# Altium schematic sheet JLINK_OB_TYPEC.SchDoc
size 292 x 193 mm
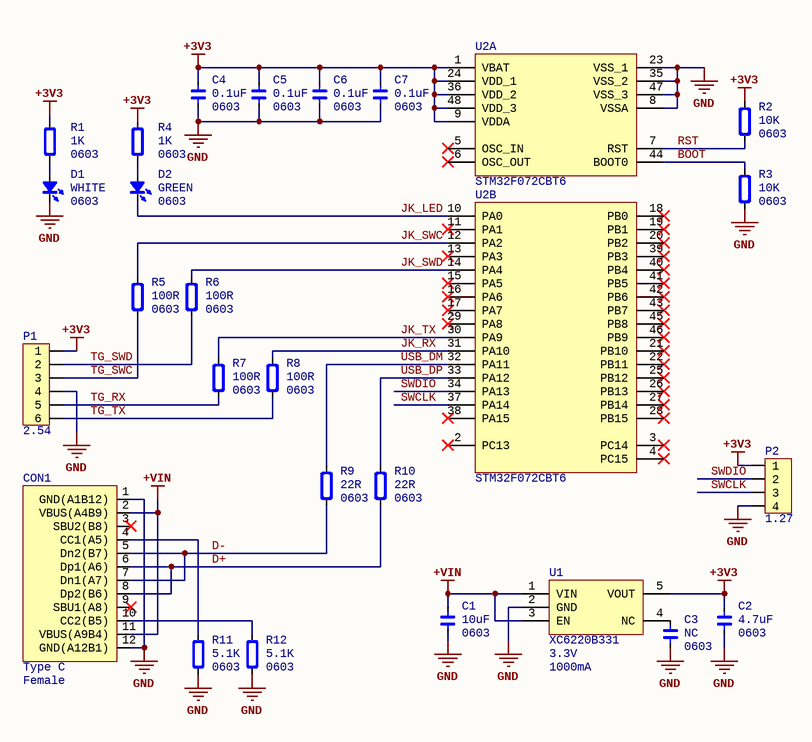
[diagram p0: JLINK_OB_TYPEC.SchDoc]

## Parts
C1  value 10uF  Type: 0603  [CAP_0603]  (hidden comment: C0603)
C2  value 4.7uF  Type: 0603  [CAP_0603]  (hidden comment: C0603)
C3  value NC  Type: 0603  [CAP_0603]  (hidden comment: C0603)
C4  value 0.1uF  Type: 0603  [CAP_0603]  (hidden comment: C0603)
C5  value 0.1uF  Type: 0603  [CAP_0603]  (hidden comment: C0603)
C6  value 0.1uF  Type: 0603  [CAP_0603]  (hidden comment: C0603)
C7  value 0.1uF  Type: 0603  [CAP_0603]  (hidden comment: C0603)
CON1  value Type C  Type: Female  [USB_TypeC_16P]  (hidden comment: USB Type C)
D1  value WHITE  Type: 0603  [LED_0603_YELLOW]  (hidden comment: D0603)
D2  value GREEN  Type: 0603  [LED_0603_GREEN]  (hidden comment: D0603)
P1  value 2.54  [HDR1X6_2.54_180]  (hidden comment: HDR1x6)
P2  value 1.27  [HDR1X4_1.27_180]  (hidden comment: HDR1x4)
R1  value 1K  Type: 0603  [RES_0603]  (hidden comment: R0603)
R2  value 10K  Type: 0603  [RES_0603]  (hidden comment: R0603)
R3  value 10K  Type: 0603  [RES_0603]  (hidden comment: R0603)
R4  value 1K  Type: 0603  [RES_0603]  (hidden comment: R0603)
R5  value 100R  Type: 0603  [RES_0603]  (hidden comment: R0603)
R6  value 100R  Type: 0603  [RES_0603]  (hidden comment: R0603)
R7  value 100R  Type: 0603  [RES_0603]  (hidden comment: R0603)
R8  value 100R  Type: 0603  [RES_0603]  (hidden comment: R0603)
R9  value 22R  Type: 0603  [RES_0603]  (hidden comment: R0603)
R10  value 22R  Type: 0603  [RES_0603]  (hidden comment: R0603)
R11  value 5.1K  Type: 0603  [RES_0603]  (hidden comment: R0603)
R12  value 5.1K  Type: 0603  [RES_0603]  (hidden comment: R0603)
U1  XC6220B331  value 3.3V  Specification: 1000mA  [SOT23-5]
U2  STM32F072CBT6  [LQFP48_P0.5_7.0x7.0]  (parts A,B of 2)

## Nets
+3V3: C2.2 C4.2 C5.2 C6.2 C7.2 P1.1 P2.1 R1.2 R2.2 R4.2 U1.5(VOUT) U2.1(VBAT) U2.9(VDDA) U2.24(VDD_1) U2.36(VDD_2) U2.48(VDD_3)
+VIN: C1.2 CON1.2(VBUS(A4B9)) CON1.11(VBUS(A9B4)) U1.1(VIN) U1.3(EN)
GND: C1.1 C2.1 C3.1 C4.1 C5.1 C6.1 C7.1 CON1.1(GND(A1B12)) CON1.12(GND(A12B1)) D1.2(CATHODE) P1.4 P2.4 R3.1 R11.1 R12.1 U1.2(GND) U2.8(VSSA) U2.23(VSS_1) U2.35(VSS_2) U2.47(VSS_3)
BOOT: R3.2 U2.44(BOOT0)
D+: CON1.6(Dp1(A6)) CON1.8(Dp2(B6)) R10.1
D-: CON1.5(Dn2(B7)) CON1.7(Dn1(A7)) R9.1
JK_LED: D2.2(CATHODE) U2.10(PA0)
JK_RX: R8.2 U2.31(PA10)
JK_SWC: R5.2 U2.12(PA2)
JK_SWD: R6.2 U2.14(PA4)
JK_TX: R7.2 U2.30(PA9)
RST: R2.1 U2.7(RST)
SWCLK: P2.3 U2.37(PA14)
SWDIO: P2.2 U2.34(PA13)
TG_RX: P1.5 R7.1
TG_SWC: P1.3 R5.1
TG_SWD: P1.2 R6.1
TG_TX: P1.6 R8.1
USB_DM: R9.2 U2.32(PA11)
USB_DP: R10.2 U2.33(PA12)
NetC3_2: C3.2 U1.4(NC)
NetCON1_4: CON1.4(CC1(A5)) R11.2
NetCON1_10: CON1.10(CC2(B5)) R12.2
NetD1_1: D1.1(ANODE) R1.1
NetD2_1: D2.1(ANODE) R4.1

Not connected (* = marked no-connect by the designer): CON1 3(SBU2(B8))* 9(SBU1(A8))* SH; U2 2(PC13)* 3(PC14)* 4(PC15)* 5(OSC_IN)* 6(OSC_OUT)* 11(PA1)* 13(PA3)* 15(PA5)* 16(PA6)* 17(PA7)* 18(PB0)* 19(PB1)* 20(PB2)* 21(PB10)* 22(PB11)* 25(PB12)* 26(PB13)* 27(PB14)* 28(PB15)* 29(PA8)* 38(PA15)* 39(PB3)* 40(PB4)* 41(PB5)* 42(PB6)* 43(PB7)* 45(PB8)* 46(PB9)*

## Notes on the sheet
- Title
- Size:
- Date:
- A4
- Number:
- Time:
- Revision:
- Sheet
- of
- File:

## Library data of the parts
C1-C7 = Cap_0603: Capacitor; Specification: X7R, 16V; Note: ±10%; Manufacturer: *; Link: *
CON1 = USB_TypeC_16P_A: USB; Link: *; Manufacturer: *; Datasheet: *; Note: *
D1 D2 = LED_0603: LED; Manufacturer: *; Specification: *; Note: *; Link: *
P1 = HDR1x6_2.54T: Header; Note: 1x6; Type: DIP
P2 = HDR1x4_1.27: Header; Note: 1x4; Type: DIP
R1-R12 = Res_0603: Resistor; Specification: 1/10W; Note: ±1%; Manufacturer: *; Link: *
U1 = XC6220x_SOT25: LDO; Manufacturer: Torex Semiconductor; Note: 6.5V; Type: SOT23-5; Datasheet: https://www.torexsemi.com/file/xc6220/XC6220.pdf; Link: https://www.torexsemi.com/products/single-type-voltage-regulators/series/?name=xc6220
U2 = STM32F072CxT: MCU ST; Manufacturer: STMicroelectronics; Note: CortexM0; Specification: 128K Flash, 16K SRAM; Value: 48MHz; Type: LQFP48; Datasheet: https://www.st.com/resource/en/datasheet/stm32f072cb.pdf; Link: https://www.st.com/content/st_com/en/products/microcontrollers-microprocessors/stm32-32-bit-arm-cortex-mcus/stm32-mainstream-mcus/stm32f0-series/stm32f0x2/stm32f072cb.html